# Altium project in3ator.PrjPcb (part 2 of 2)

## Sheet ESD_Protection.SchDoc
size A4
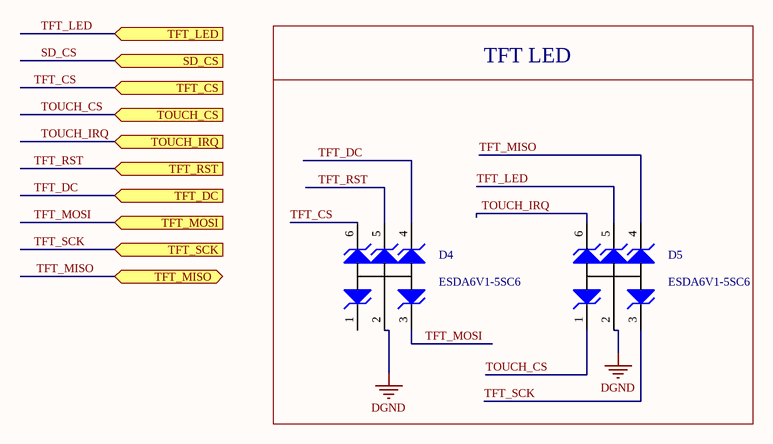
[diagram p9: ESD_Protection.SchDoc]

### Parts
D4  ESDA6V1-5SC6  [MF06A_N]
D5  ESDA6V1-5SC6  [MF06A_N]

### Blocks framed on the sheet
TFT LED: D4 D5

### Ports
SD_CS (in), TFT_CS (in), TFT_DC (in), TFT_LED (in), TFT_MISO, TFT_MOSI (in), TFT_RST (in), TFT_SCK (in), TOUCH_CS (in), TOUCH_IRQ (in)

### Nets
DGND: D4.2(K) D5.2(K)
TFT_CS: D4.6(A) ; port TFT_CS
TFT_DC: D4.4(A) ; port TFT_DC
TFT_LED: D5.5(A) ; port TFT_LED
TFT_MISO: D5.4(A) ; port TFT_MISO  [project net SPI_MISO]
TFT_MOSI: D4.3(K) ; port TFT_MOSI  [project net SPI_MOSI]
TFT_RST: D4.5(A) ; port TFT_RST
TFT_SCK: D5.3(K) ; port TFT_SCK  [project net SPI_SCK]
TOUCH_CS: D5.1(K) ; port TOUCH_CS
TOUCH_IRQ: D5.6(A) ; port TOUCH_IRQ

Not connected (* = marked no-connect by the designer): D4 1(K)

### Library data of the parts
D4 D5 = CMP-924f5b40f9684d88-1: ESDA Series 5 Channel 6.1 V 50 pF SMT Uni Directional Transil Array - SOT-23-6L; Operating Voltage: 6.10 V; Power Rating: 100 W; Breakdown Voltage: 7.20 V; Lead-Free Status: Lead Free; REACH SVHC Compliance: No SVHC; Number of Pins: 6; Case/Package: SOT-23; Size-Width: 1.75 mm; Mounting Style: Surface Mount; Manufacturer Part Number: ESDA6V1-5SC6; Size-Height: 1.45 mm; OctopartID: 924f5b40f9684d88; Size-Length: 3.05 mm; Packaging: Tape & Reel (TR), Cut Tape (CT); Octopart URL: http://octopart.com/esda6v1-5sc6-stmicroelectronics-347713; RoHS: Compliant; Voltage Rating (DC): 6.10 V; Lifecycle Status: Active; TME: ESDA6V1-5SC6

## Nets that join several sheets
3v3_an@250mA: Power_management (C27.2 U9.2), Sensors (5 pins), uC (C6.1 U1#1.13), Screen (Q8.2 R45.1)
3v3_dig@250mA: Power_management (C28.2 U10.2), Sensors (13 pins), uC (10 pins), Buzzer (BUZ1.1 R43.2), Screen (U8.1)
3v3_pulsioximeter: Sensors (J8.5 J9.4), uC (U1#2.57)
4V1@2A: Power_management (6 pins), GSM (C8.2 U2.34 U2.35), Actuators (R42.2)
AGND: Power_management (C27.1 FB1.1 U9.1), Sensors (11 pins), uC (C6.2 U1#1.12)
DC_IN: Power_management (7 pins), Power_Input (F1.2)
DGND: Power_management (12 pins), GSM (27 pins), Sensors (22 pins), uC (13 pins), Power_Input (R1.1), Actuators (13 pins), Buzzer (Q7.2), Screen (U8.2), ESD_Protection (D4.2 D5.2)
GND Shunt: Sensors (R30.1), Power_Input (D1.1 F2.1 J1.2 R1.2)
Vpower: Power_management (Q9.2 Rsc1.1), Actuators (6 pins)
GSM_RX: GSM (GSM_RX.1 R12.1), uC (U1#2.42)
GSM_TX: GSM (GSM_TX.1 R10.1), uC (U1#2.43)
NetC17_1: Sensors (C17.1 J6.1 R25.2), uC (U1#2.9)
NetC18_2: Sensors (C18.2 SW1.5), uC (U1#2.40)
NetC19_2: Sensors (C19.2 SW1.3), uC (U1#2.39)
NetC20_2: Sensors (C20.2 SW1.2), uC (U1#2.25)
NetC34_1: Sensors (C34.1 J12.1 R54.2), uC (U1#2.11)
NetQ2_1: uC (R4.1), Actuators (Q2.1 R19.2)
NetQ3_1: uC (R5.1), Actuators (Q3.1 R20.2)
NetQ4_1: uC (R6.1), Actuators (Q4.1 R21.2)
NetQ5_1: uC (R8.1), Actuators (Q5.1 R23.2)
NetQ6_1: uC (U1#2.27), Actuators (Q6.1 R24.2)
NetR7_1: GSM (R9.2), uC (R7.1 U1#2.60)
NetR13_1: GSM (R13.1), uC (U1#2.3)
NetR44_2: uC (U1#2.37), Buzzer (R44.2)
NetR48_1: Power_management (R48.1), uC (U1#2.33)
NetU1#2_56: Sensors (U4.1), uC (U1#2.56)
PULSIOXIMETER_: Sensors (6 pins), uC (U1#2.15)
SCL: Sensors (J10.2 J11.3 R37.2 U7.2), uC (U1#2.29)
SD_CS: uC (U1#2.44), Screen (U8.10)
SDA: Sensors (J10.3 J11.2 R38.2 U7.3), uC (U1#2.30)
SPI_MISO: uC (U1#2.22), Screen (U8.9 U8.12 U8.17), ESD_Protection (D5.4)
SPI_MOSI: uC (U1#2.23), Screen (U8.6 U8.11 U8.16), ESD_Protection (D4.3)
SPI_SCK: uC (U1#2.21), Screen (U8.7 U8.13 U8.14), ESD_Protection (D5.3)
SYS_CURRENT: Sensors (R28.1 U4.3 U4.7), uC (U1#2.14)
TFT_CS: uC (U1#2.2), Screen (U8.3), ESD_Protection (D4.6)
TFT_DC: uC (U1#2.61), Screen (U8.5), ESD_Protection (D4.4)
TFT_LED: Screen (Q8.3 U8.8), ESD_Protection (D5.5)
TFT_LED_CTL: uC (U1#2.58), Screen (R46.2)
TFT_RST: uC (U1#2.54), Screen (U8.4), ESD_Protection (D4.5)
TOUCH_CS: uC (U1#2.62), Screen (U8.15), ESD_Protection (D5.1)
TOUCH_IRQ: uC (U1#2.4), Screen (U8.18), ESD_Protection (D5.6)

## Assembly variants
Main: not fitted C9 C9 C9 C10 C10 C10 C13 C21 C22 C23 C24 C25 C33 D3 F1 J2 J3 J7 J8 J8 J9 J12 R9 R32 R33 R33 R34 R35 R36 R39 R40 RF_1 Rsc U3 U5 U6